# EAGLE design OpIoT_v_1_2 (EAGLE 9.1.0)
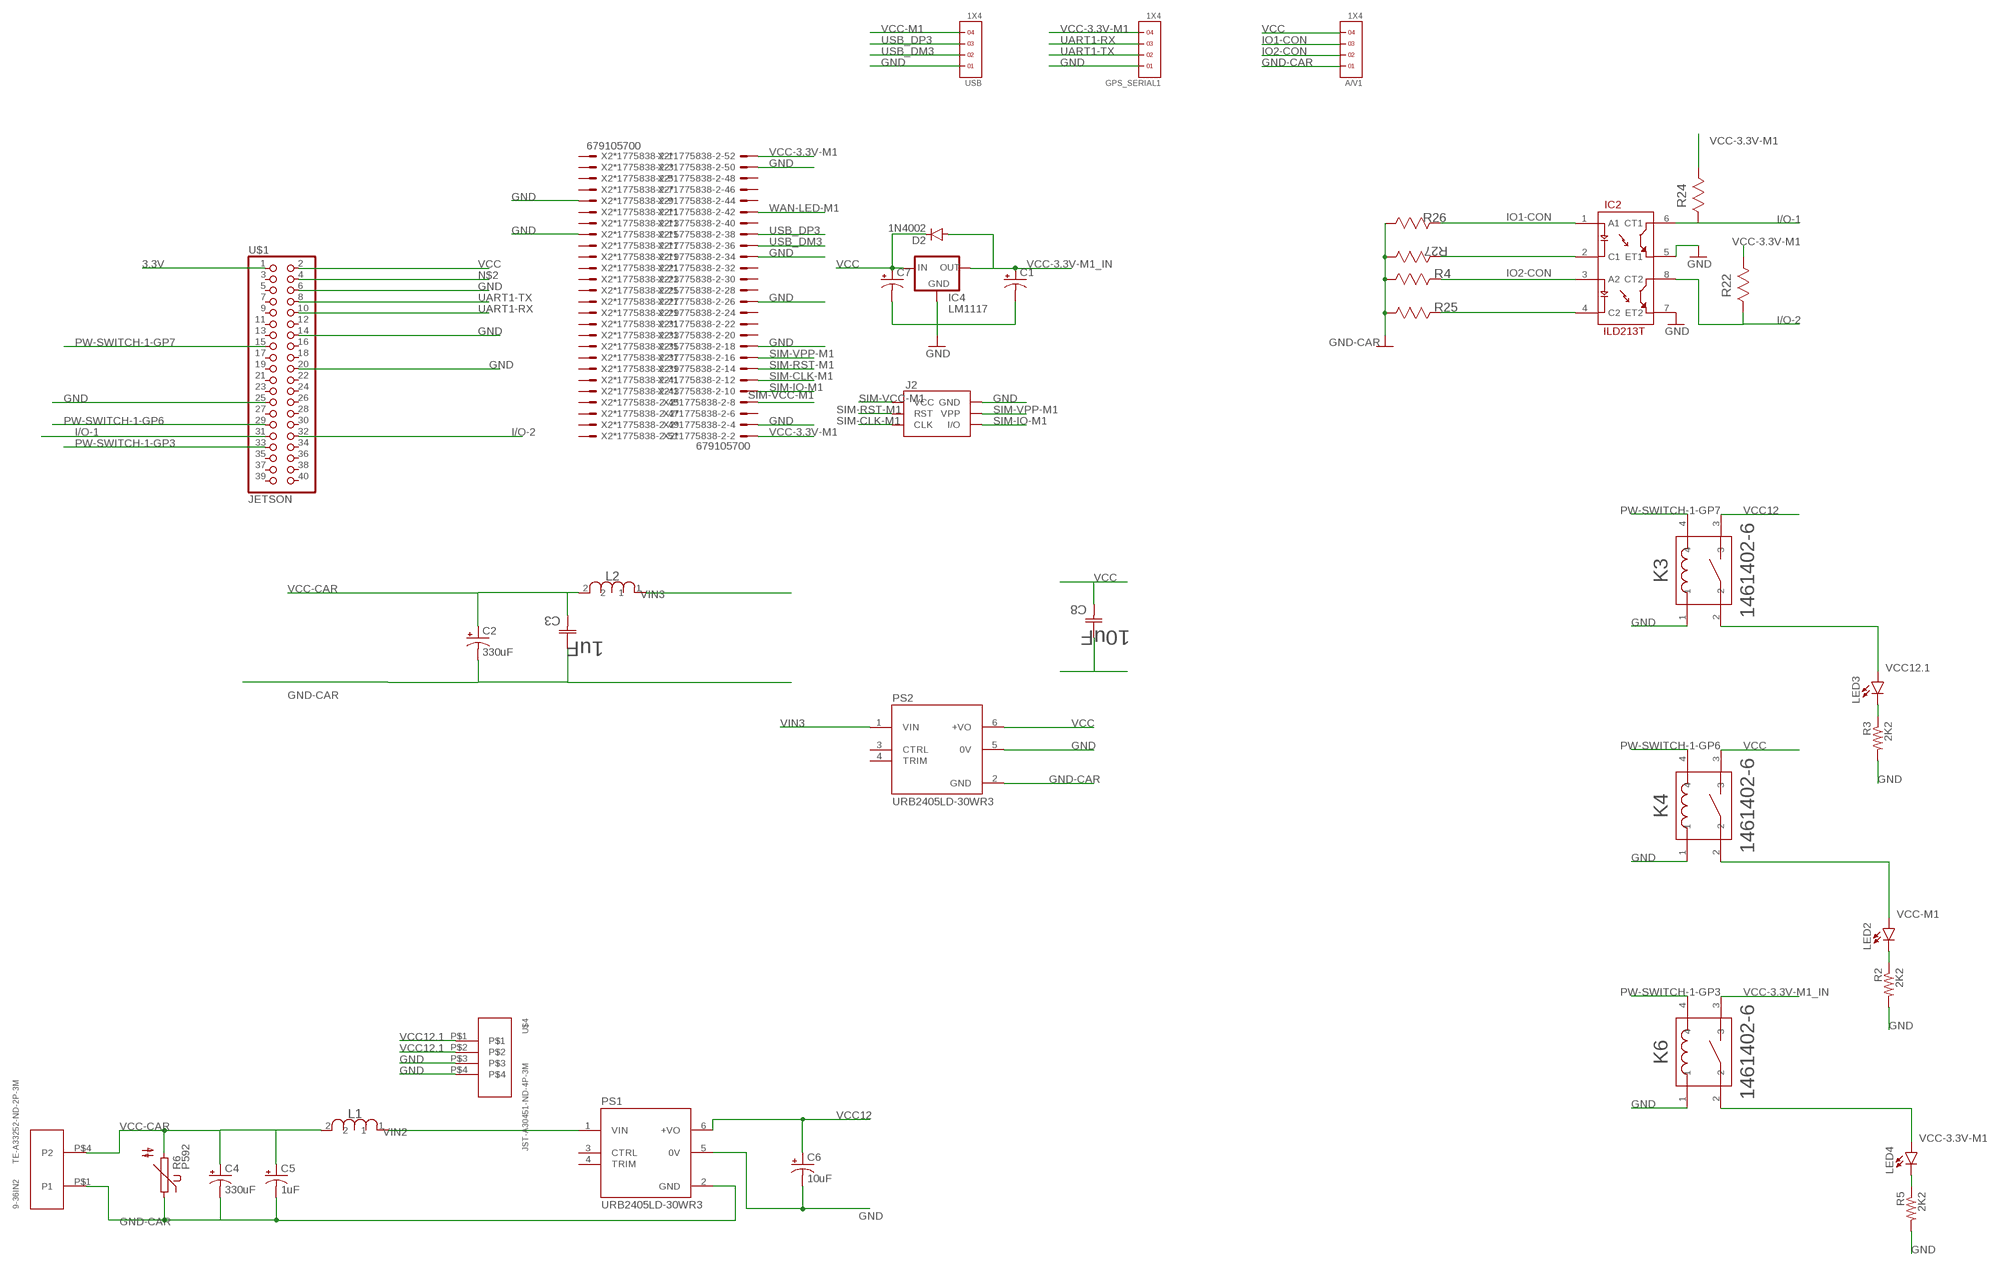
[diagram p0: schematic, sheet 1]

## Parts
9-36IN2  TE-A33252-ND-2P-3M  [TE-A33252-ND-2P-3M]
A/V1  1X4  [1X4]
C1  CAP_POL1206-KIT  [EIA3216-KIT]
C2  330uF  CPOL-USUD-10X10  [UD-10X10_NICHICON]
C3  1uF  C1206C105K5RACTU  [CAPC3216X110N]
C4  330uF  CPOL-USUD-10X10  [UD-10X10_NICHICON]
C5  1uF  CAP_POL1206-KIT  [EIA3216-KIT]
C6  10uF  CAP_POL1206-KIT  [EIA3216-KIT]
C7  CAP_POL1206-KIT  [EIA3216-KIT]
C8  10uF  C1206C105K5RACTU  [CAPC3216X110N]
D2  1N4002  DIODESMA-KIT  [SMA-DIODE-KIT]
GPS_SERIAL1  1X4  [1X4]
IC2  ILD213T  [SO08]
IC4  LM1117  [SOT223]
J2  SIMHOLDERSIM  [SIMHOLDER]
K3  1461402-6  [RELAY_1461402-6]
K4  1461402-6  [RELAY_1461402-6]
K6  1461402-6  [RELAY_1461402-6]
L1  4.7uH  PM1210-1R0J-RC  [INDC3225X22N]
L2  4.7uH  PM1210-1R0J-RC  [INDC3225X22N]
LED2  LEDCHIPLED_1206  [CHIPLED_1206]
LED3  LEDCHIPLED_1206  [CHIPLED_1206]
LED4  LEDCHIPLED_1206  [CHIPLED_1206]
PS1  URB2405LD-30WR3  [CONV_URB2405LD-30WR3]
PS2  URB2405LD-30WR3  [CONV_URB2405LD-30WR3]
R2  2K2  R-US_M1206  [M1206]
R3  2K2  R-US_M1206  [M1206]
R4  4K7  ERJ-8ENF1501V  [RESC3216X71N]
R5  2K2  R-US_M1206  [M1206]
R6  P592  [P592]
R22  300K  ERJ-8ENF1501V  [RESC3216X71N]
R24  300K  ERJ-8ENF1501V  [RESC3216X71N]
R25  2.2K  ERJ-8ENF1501V  [RESC3216X71N]
R26  4K7  ERJ-8ENF1501V  [RESC3216X71N]
R27  2.2K  ERJ-8ENF1501V  [RESC3216X71N]
U$1  JETSON  [2X20]
U$4  JST-A30451-ND-4P-3M  [TE-A30451-4P-TH-3M]
USB  1X4  [1X4]
X2*1775838-2  679105700  [679105700]

## Nets
3.3V: U$1.1
GND: C1.C(-) C6.C(-) C7.C(-) C8.1(C1) GPS_SERIAL1.1 IC2.5(ET1) IC2.7(ET2) IC4.1(GND) J2.C5(GND) K3.1 K4.1 K6.1 PS1.5(0V) PS2.5(0V) R2.2 R3.2 R5.2 U$1.6 U$1.14 U$1.20 U$1.25 U$4.P$3 U$4.P$4 USB.1 X2*1775838-2.4 X2*1775838-2.9 X2*1775838-2.15 X2*1775838-2.18 X2*1775838-2.26 X2*1775838-2.34 X2*1775838-2.50
GND-CAR: 9-36IN2.P$1(P1) A/V1.1 C2.- C3.1(C1) C4.- C5.C(-) PS1.2(GND) PS2.2(GND) R4.2(R2) R6.1 R25.1(R1) R26.2(R2) R27.1(R1)
I/O-1: IC2.6(CT1) R24.2(R2) U$1.31
I/O-2: IC2.8(CT2) R22.2(R2) U$1.32
IO1-CON: A/V1.3 IC2.1(A1) R26.1(R1)
IO2-CON: A/V1.2 IC2.3(A2) R4.1(R1)
N$2: U$1.4
N$3: LED2.C R2.1
N$4: LED3.C R3.1
N$5: LED4.C R5.1
N$7: IC2.2(C1) R27.2(R2)
N$9: IC2.4(C2) R25.2(R2)
PW-SWITCH-1-GP3: K6.4 U$1.33
PW-SWITCH-1-GP6: K4.4 U$1.29
PW-SWITCH-1-GP7: K3.4 U$1.15
SIM-CLK-M1: J2.C3(CLK) X2*1775838-2.12
SIM-IO-M1: J2.C7(I/O) X2*1775838-2.10
SIM-RST-M1: J2.C2(RST) X2*1775838-2.14
SIM-VCC-M1: J2.C1(VCC) X2*1775838-2.8
SIM-VPP-M1: J2.C6(VPP) X2*1775838-2.16
UART1-RX: GPS_SERIAL1.3 U$1.10
UART1-TX: GPS_SERIAL1.2 U$1.8
USB_DM3: USB.2 X2*1775838-2.36
USB_DP3: USB.3 X2*1775838-2.38
VCC: A/V1.4 C7.A(+) C8.2(C2) D2.C IC4.3(IN) K4.3 PS2.6(+VO) U$1.2
VCC12: C6.A(+) K3.3 PS1.6(+VO)
VCC12.1: K3.2 LED3.A U$4.P$1 U$4.P$2
VCC-3.3V-M1: GPS_SERIAL1.4 K6.2 LED4.A R22.1(R1) R24.1(R1) X2*1775838-2.2 X2*1775838-2.52
VCC-3.3V-M1_IN: C1.A(+) D2.A IC4.2(OUT) K6.3
VCC-CAR: 9-36IN2.P$4(P2) C2.+ C3.2(C2) C4.+ C5.A(+) L1.2 L2.2 R6.2
VCC-M1: K4.2 LED2.A USB.4
VIN2: L1.1 PS1.1(VIN)
VIN3: L2.1 PS2.1(VIN)
WAN-LED-M1: X2*1775838-2.42
Unconnected: PS1.3(CTRL) PS1.4(TRIM) PS2.3(CTRL) PS2.4(TRIM) U$1.3 U$1.5 U$1.7 U$1.9 U$1.11 U$1.12 U$1.13 U$1.16 U$1.17 U$1.18 U$1.19 U$1.21 U$1.22 U$1.23 U$1.24 U$1.26 U$1.27 U$1.28 U$1.30 U$1.34 U$1.35 U$1.36 U$1.37 U$1.38 U$1.39 U$1.40 X2*1775838-2.1 X2*1775838-2.3 X2*1775838-2.5 X2*1775838-2.6 X2*1775838-2.7 X2*1775838-2.11 X2*1775838-2.13 X2*1775838-2.17 X2*1775838-2.19 X2*1775838-2.20 X2*1775838-2.21 X2*1775838-2.22 X2*1775838-2.23 X2*1775838-2.24 X2*1775838-2.25 X2*1775838-2.27 X2*1775838-2.28 X2*1775838-2.29 X2*1775838-2.30 X2*1775838-2.31 X2*1775838-2.32 X2*1775838-2.33 X2*1775838-2.35 X2*1775838-2.37 X2*1775838-2.39 X2*1775838-2.40 X2*1775838-2.41 X2*1775838-2.43 X2*1775838-2.44 X2*1775838-2.45 X2*1775838-2.46 X2*1775838-2.47 X2*1775838-2.48 X2*1775838-2.49 X2*1775838-2.51

## Library data of the parts
9-36IN2 = MonkeyTech:TE-A33252-ND-2P-3M
A/V1 GPS_SERIAL1 USB = headers(2mm):1X4
C1 C5-C7 = SparkFun-Passives:CAP_POL: Capacitor Polarized These are standard SMD and PTH capacitors. Normally 10uF, 47uF, and 100uF in electrolytic and tantalum varieties. Always verify the external diameter of the through hole cap, it varies with capacity, voltage, and manufacturer. The EIA devices should be standard.
C2 C4 = rcl:CPOL-US: POLARIZED CAPACITOR, American symbol; SPICEPREFIX: C
C3 = Kemet_By_element14_Batch_1:C1206C105K5RACTU: CAPACITOR, 1206; MPN: C1206C105K5RACTU; OC_FARNELL: 1288207; OC_NEWARK: 93K6006; SUPPLIER: Kemet; TOLERANCE: ±10%; VOLTAGERATING: 50V
C8 = Kemet_By_element14_Batch_1:C1206C105K5RACTU: CAPACITOR, 1206; MPN: C1206C105K5RACTU; OC_FARNELL: 1288207; OC_NEWARK: 93K6006; SUPPLIER: Kemet; TOLERANCE: ±10%; VALUE: 1uF; VOLTAGERATING: 50V
D2 = SparkFun-DiscreteSemi:DIODE: Diode These are standard reverse protection diodes and small signal diodes. SMA package can handle up to about 1A. SOD-323 can handle about 200mA. What the SOD-323 package when ordering, there are some mfgs out there that are 5-pin packages.
IC2 = SparkFun-DiscreteSemi:ILD213T: Dual optoisolator.
IC4 = LM1117:LM1117; AVAILABILITY: Good; DESCRIPTION: Voltage stabiliser; LDO, fixed; 3.3V; 0.8A; SOT223; SMD; MF: Texas Instruments; MP: LM1117MP-3.3/NOPB; PACKAGE: SOT-223 Texas Instruments; PRICE: 0.61 USD
J2 = SparkFun-Connectors:SIMHOLDER: SIM Socket Socket for SIM cellular cards. Schematic element and footprint production proven. Spark Fun Electronics SKU : PRT-00548; PROD_ID: CONN-08536
K3 K4 K6 = 1461402-6:1461402-6: Electromechanical Relay 12VDC 320Ohm 10A SPST-NO (( 18.2mm 10.2mm 14.7mm)) THT Industrial Relay Check prices <https://pricing.snapeda.com/search/part/OJE-SH-112HM%2C000/?ref=eda>; AVAILABILITY: Warning; COMMENT: 1461402-6; DESCRIPTION: Electromechanical Relay 12VDC 320Ohm 10A SPST-NO (( 18.2mm 10.2mm 14.7mm)) THT Industrial Relay; MF: TE Connectivity; MP: OJE-SH-112HM,000; PACKAGE: None; PRICE: None; PURCHASE-URL: https://pricing.snapeda.com/search/part/OJE-SH-112HM,000/?ref=eda
L1 L2 = Bourns_By_element14_Batch_1:PM1210-1R0J-RC: CHIP INDUCTOR, 1UH, 400MA 5% 120MHZ; MPN: PM1210-1R0J-RC; OC_FARNELL: 1180462; OC_NEWARK: 63K3090; SUPPLIER: BOURNS; TOLERANCE: ±5 %; VALUE: 1.0 uH
LED2-LED4 = led:LED: LED OSRAM: - CHIPLED LG R971, LG N971, LY N971, LG Q971, LY Q971, LO R971, LY R971 LH N974, LH R974 LS Q976, LO Q976, LY Q976 LO Q996 - Hyper CHIPLED LW Q18S LB Q993, LB Q99A, LB R99A - SideLED LS A670, LO A670, LY A670, LG A670, LP A670 LB A673, LV A673, LT A673, LW A673 LH A674 LY A675 LS A676, LA A676, LO A676, LY A676, LW A676 LS A679, LY A679, LG A679 - Hyper Micro SIDELED® LS Y876, LA Y876, LO Y876, LY Y876 LT Y87S - SmartLED LW L88C, LW L88S LB L89C, LB L89S, LG L890 LS L89K, LO L89K, LY L89K LS L896, LA L896, LO L896, LY L896 - TOPLED LS T670, LO T670, LY T670, LG T670, LP T670 LSG T670, LSP T670, LSY T670, LOP T670, LYG T670 LG T671, LOG T671, LSG T671 LB T673, LV T673, LT T673, LW T673 LH T674 LS T676, LA T676, LO T676, LY T676, LB T676, LH T676, LSB T676, LW T676 LB T67C, LV T67C, LT T67C, LS T67K, LO T67K, LY T67K, LW E67C LS E67B, LA E67B, LO E67B, LY E67B, LB E67C, LV E67C, LT E67C LW T67C LS T679, LY T679, LG T679 LS T770, LO T770, LY T770, LG T770, LP T770 LB T773, LV T773, LT T773, LW T773 LH T774 LS E675, LA E675, LY E675, LS T675 LS T776, LA T776, LO T776, LY T776, LB T776 LHGB T686 LT T68C, LB T68C - Hyper Mini TOPLED® LB M676 - Mini TOPLED Santana® LG M470 LS M47K, LO M47K, LY M47K Source: http://www.osram.convergy.de LUXEON: - LUMILED® LXK2-PW12-R00, LXK2-PW12-S00, LXK2-PW14-U00, LXK2-PW14-V00 LXK2-PM12-R00, LXK2-PM12-S00, LXK2-PM14-U00 LXK2-PE12-Q00, LXK2-PE12-R00, LXK2-PE12-S00, LXK2-PE14-T00, LXK2-PE14-U00 LXK2-PB12-K00, LXK2-PB12-L00, LXK2-PB12-M00, LXK2-PB14-N00, LXK2-PB14-P00, LXK2-PB14-Q00 LXK2-PR12-L00, LXK2-PR12-M00, LXK2-PR14-Q00, LXK2-PR14-R00 LXK2-PD12-Q00, LXK2-PD12-R00, LXK2-PD12-S00 LXK2-PH12-R00, LXK2-PH12-S00 LXK2-PL12-P00, LXK2-PL12-Q00, LXK2-PL12-R00 Source: www.luxeon.com KINGBRIGHT: KA-3528ASYC Source: www.kingbright.com
PS1 PS2 = URB2405LD-30WR3:URB2405LD-30WR3: URB_LD-30WR3 series are isolated 30W DC-DC products with 4:1 input voltage; AVAILABILITY: Unavailable; DESCRIPTION: URB_LD-30WR3 series are isolated 30W DC-DC products with 4:1 input voltage; MF: MORNSUN; MP: URB2405LD-30WR3; PACKAGE: Package; PRICE: None
R2 R3 R5 = rcl:R-US_: RESISTOR, American symbol; SPICEPREFIX: R
R4 R22 R24-R27 = Panasonic_By_element14_Batch_1:ERJ-8ENF1501V: RESISTOR, 1206; MPN: ERJ-8ENF1501V; OC_FARNELL: 1748434; OC_NEWARK: 64R5441; SUPPLIER: Panasonic; TOLERANCE: ±1 %; VALUE: 1.5 KOhm; WATTAGE: 0.25 W
R6 = varistor:P592: VARISTOR
U$1 = Jetson:JETSON
U$4 = MonkeyTech:JST-A30451-ND-4P-3M
X2*1775838-2 = con-molex:679105700: MINI PCI EXPRESS CONNECTOR 0.8MM PITCH, 52 CIRCUIT Source: http://www.molex.com/pdm_docs/sd/679105700_sd.pdf; MF: MOLEX; MPN: 67910-5700; OC_FARNELL: unknown; OC_NEWARK: 93M2128

## Net classes
1 power: width 0.305 mm

## Board
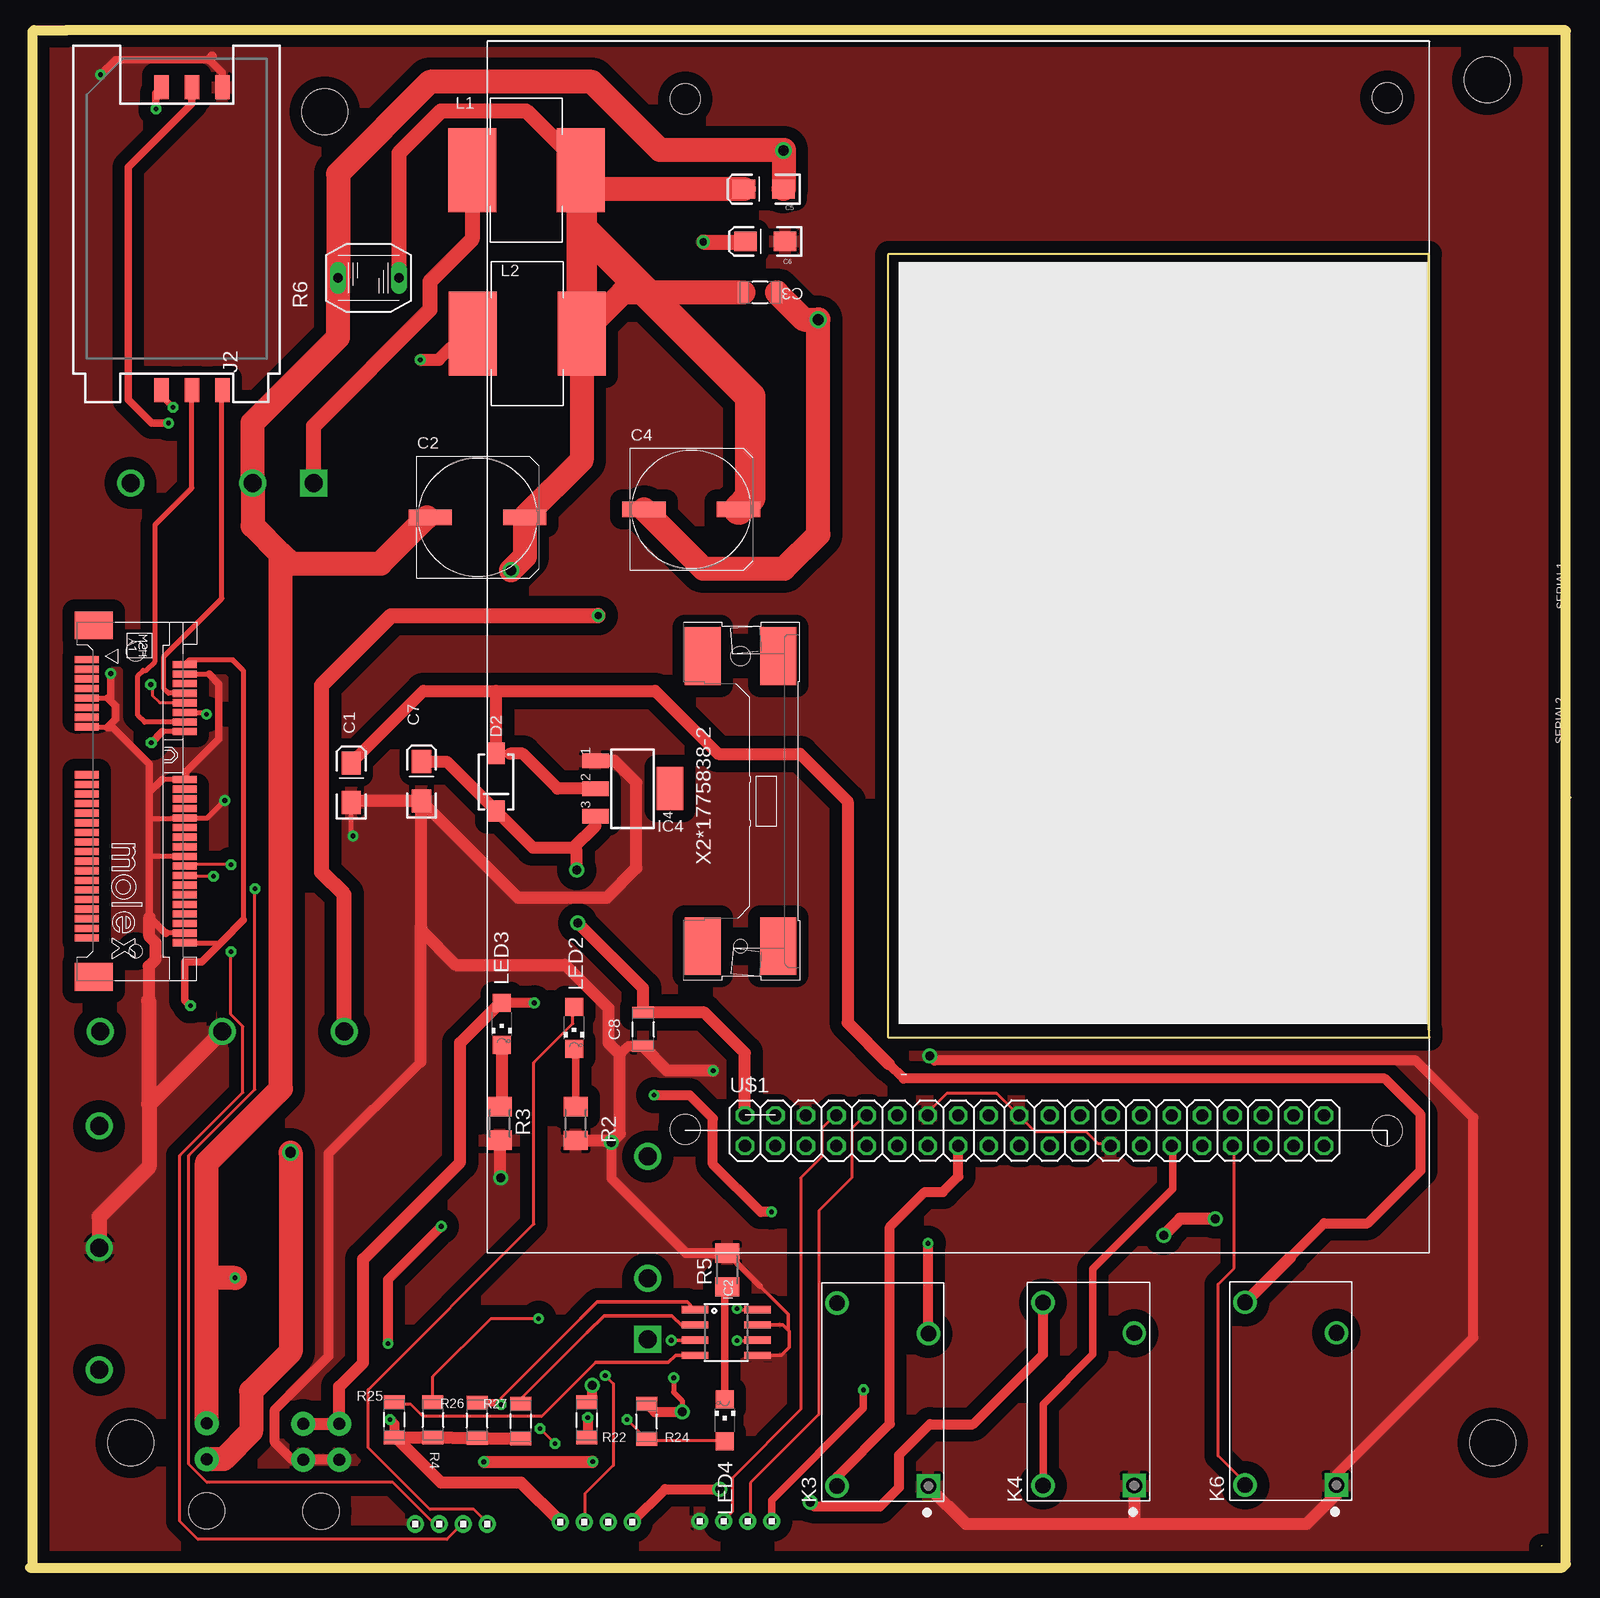
[diagram p1: board, top side]
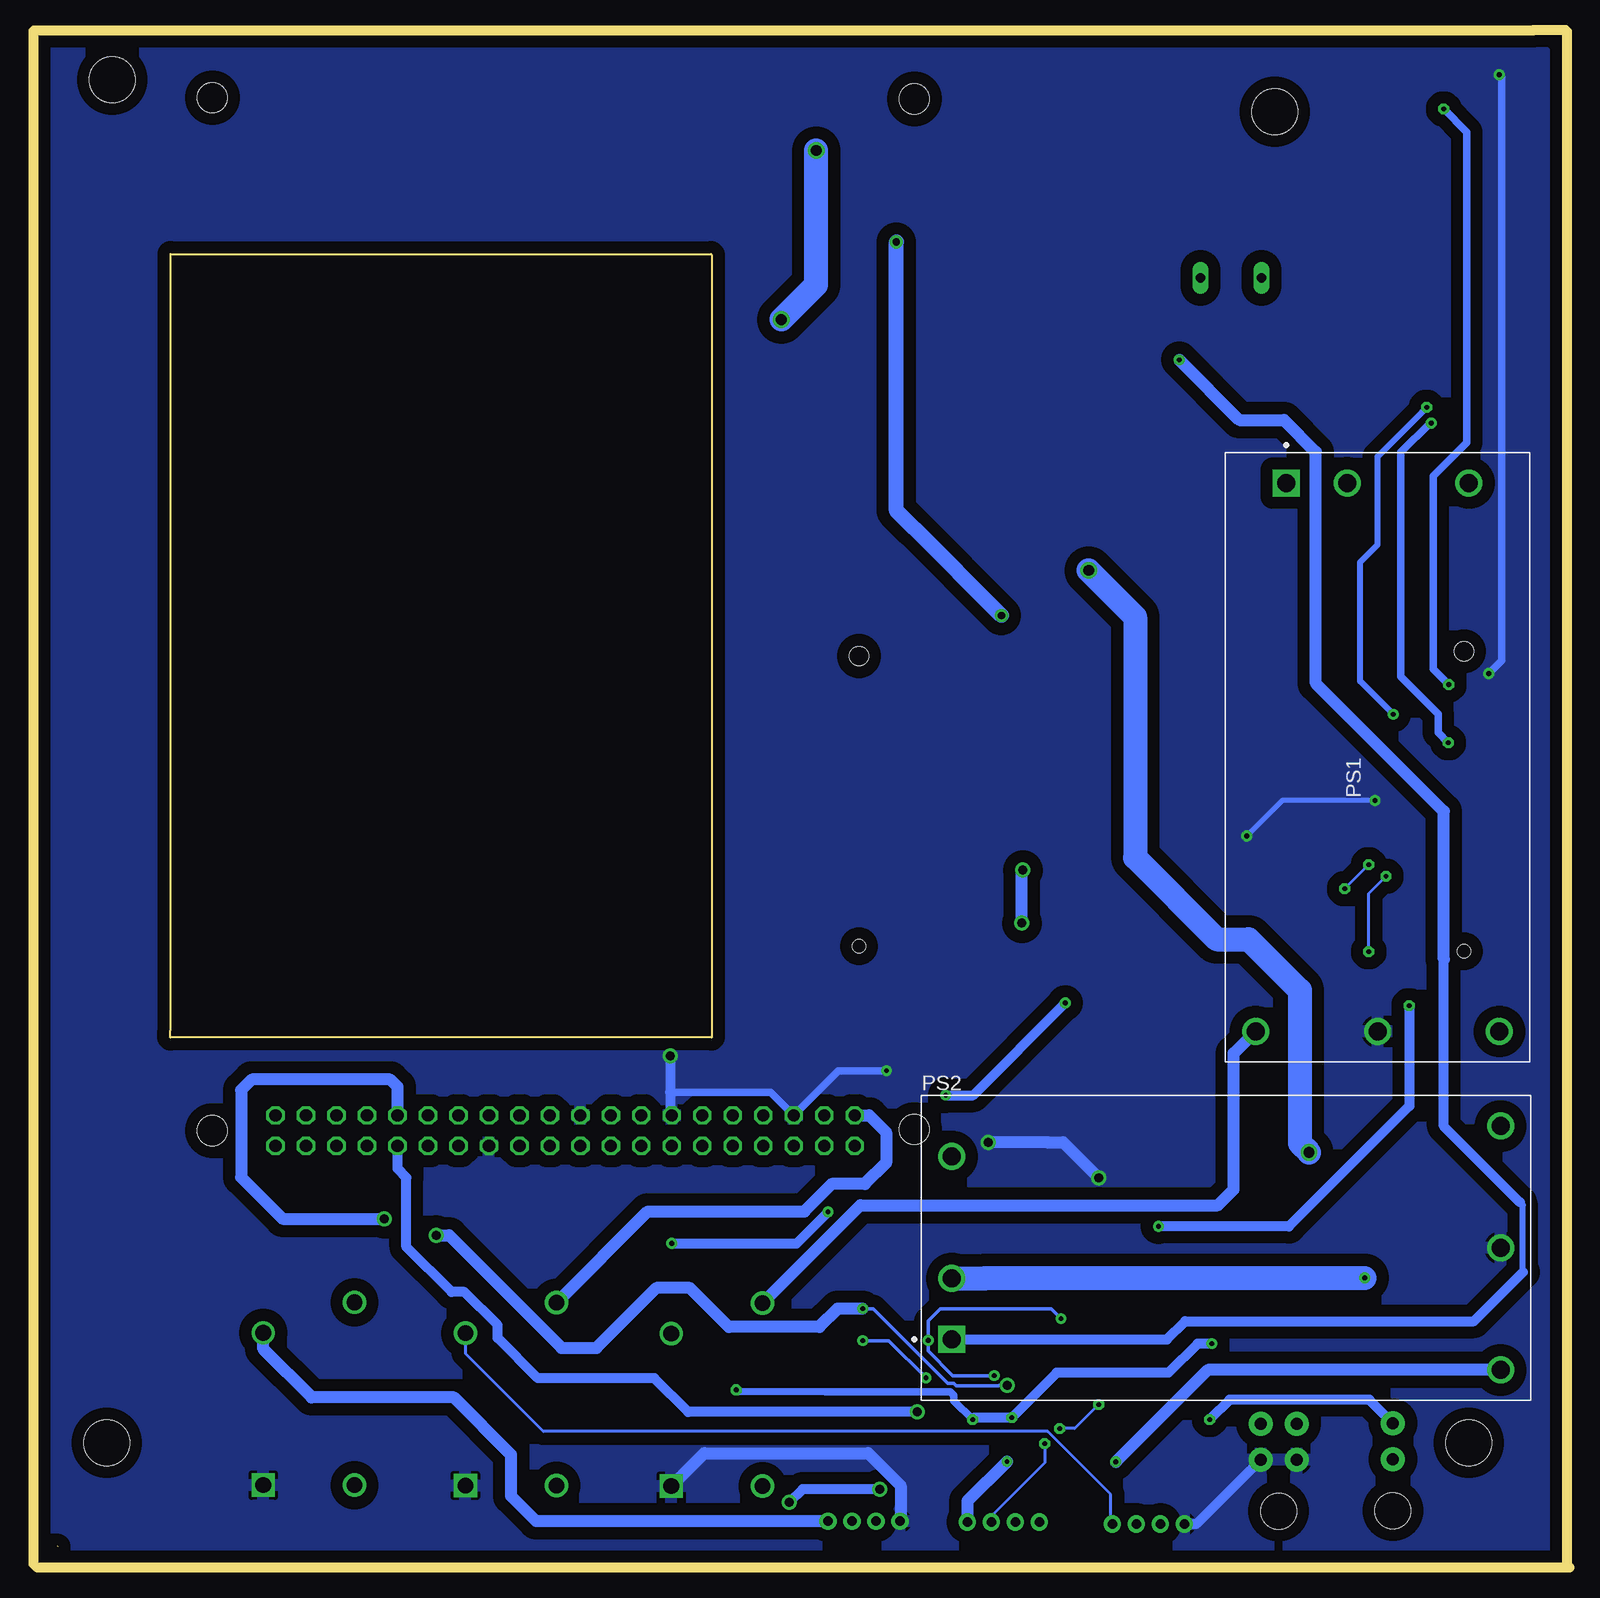
[diagram p2: board, bottom side, seen from below]

Size 128.3 x 128.18 mm. Coordinates in mm from the lower left corner, seen from the top.
Outline: 128.3,64.19 128.12,64.37
Outline: 116.58,44.81 116.58,109.48 116.6,109.5 71.56,109.5 71.49,109.42 71.49,44.23 71.52,44.2 116.61,44.2 116.64,44.23 116.6,44.27 116.6,44.8
Outline: 126.01,1.84 125.94,1.77
Outline: 0,0 127.69,0 128,0.3 128,128.11 127.96,128.15 3.04,128.15 3.02,128.16
Outline: 0.21,0 0.21,128.05 0.35,128.18 3.05,128.18
Copper layers (1*16): Top 0.035mm / dielectric 1.6mm / Bottom 0.035mm
Design rules "Check_Rule_Microcircuitos": minimum track width 0.25mm, minimum drill 0.4mm, track to track 0.25mm, track to pad 0.25mm, pad to pad 0.25mm, via to via 0.25mm, smd to smd 0mil, copper to edge 0.6mm, drill to drill 0.4mm, minimum pad ring 0.25mm, minimum via ring 0.25mm, stop-mask expansion 0mil, vias tented up to drill 0.4mm, thermal gap 0.25mm
Holes 3.81 mm at 121.9,10.41 8.39,10.41 24.57,121.38 121.45,124.05

### Footprints (pad centres in the part's own frame; a part is rotated, then mirrored left to right if it is on the bottom)
TE-A33252-ND-2P-3M = drill 1 pad 2: P$1 -0.23,-1.14; P$4 -0.23,-4.14 | hole 3: -0.23,-8.44
1X4 = drill 0.8 pad 1.422: 1 -3,0; 2 -1,0; 3 1,0; 4 3,0
EIA3216-KIT = smd 1.9 x 1.6: A 1.65,0; C -1.65,0
UD-10X10_NICHICON = smd 3.6 x 1.3: + 3.925,0; - -3.95,0
CAPC3216X110N = smd 0.914 x 1.803: 1 -1.397,0; 2 1.397,0
SMA-DIODE-KIT = smd 1.77 x 1.47: A -2.4,0; C 2.4,0
SO08 = smd 0.61 x 2.21: 1 -1.905,-2.616; 2 -0.635,-2.616; 3 0.635,-2.616; 4 1.905,-2.616; 5 1.905,2.616; 6 0.635,2.616; 7 -0.635,2.616; 8 -1.905,2.616
SOT223 = smd 1.219 x 2.235: 1 -2.311,-3.099; 2 0,-3.099; 3 2.311,-3.099 | smd 3.6 x 2.2: 4 0,3.099
SIMHOLDER = smd 2 x 1.2: C1 -12.61,-3.81; C2 -12.61,-1.27; C3 -12.61,1.27; C5 12.61,-3.81; C6 12.61,-1.27; C7 12.61,1.27
RELAY_1461402-6 = drill 1.3 square: 1 -7.62,-3.8 | drill 1.3: 2 5.08,-3.8; 3 7.62,3.8; 4 -7.62,3.8
INDC3225X22N = smd 4 x 7: 1 -0.524,0; 2 8.524,0
CHIPLED_1206 = smd 1.5 x 1.5: A 0,-1.75; C 0,1.75
CONV_URB2405LD-30WR3 = drill 1.5 square: 1 -22.86,-7.62 | drill 1.5: 2 -22.86,-2.54; 3 -22.86,7.62; 4 22.86,10.16; 5 22.86,0; 6 22.86,-10.16
M1206 = smd 1.6 x 2: 1 -1.4,0; 2 1.4,0
RESC3216X71N = smd 1.118 x 1.753: 1 -1.473,0; 2 1.473,0
P592 = drill 0.813 long: 1 0,2.54; 2 0,-2.54
2X20 = drill 1.016 octagon: 1 -28.53,0.93; 2 -28.53,3.47; 3 -25.99,0.93; 4 -25.99,3.47; 5 -23.45,0.93; 6 -23.45,3.47; 7 -20.91,0.93; 8 -20.91,3.47; 9 -18.37,0.93; 10 -18.37,3.47; 11 -15.83,0.93; 12 -15.83,3.47; 13 -13.29,0.93; 14 -13.29,3.47; 15 -10.75,0.93; 16 -10.75,3.47; 17 -8.21,0.93; 18 -8.21,3.47; 19 -5.67,0.93; 20 -5.67,3.47; 21 -3.13,0.93; 22 -3.13,3.47; 23 -0.59,0.93; 24 -0.59,3.47; 25 1.95,0.93; 26 1.95,3.47; 27 4.49,0.93; 28 4.49,3.47; 29 7.03,0.93; 30 7.03,3.47; 31 9.57,0.93; 32 9.57,3.47; 33 12.11,0.93; 34 12.11,3.47; 35 14.65,0.93; 36 14.65,3.47; 37 17.19,0.93; 38 17.19,3.47; 39 19.73,0.93; 40 19.73,3.47 | hole 2.5: 25,2.2; -33.5,2.3; -33.5,2.3; 25,88.3; -33.5,88.2
TE-A30451-4P-TH-3M = drill 1 pad 2: P$1 -1.5,-1.3; P$2 1.5,-1.3; P$3 1.5,-4.3; P$4 -1.5,-4.3 | hole 3: 0,-8.6
679105700 = smd 0.6 x 2: 1 0.7,-4.1; 2 1.1,4.1; 3 1.5,-4.1; 4 1.9,4.1; 5 2.3,-4.1; 6 2.7,4.1; 7 3.1,-4.1; 8 3.5,4.1; 9 3.9,-4.1; 10 4.3,4.1; 11 4.7,-4.1; 12 5.1,4.1; 13 5.5,-4.1; 14 5.9,4.1; 15 6.3,-4.1; 16 6.7,4.1; 17 10.3,-4.1; 18 10.7,4.1; 19 11.1,-4.1; 20 11.5,4.1; 21 11.9,-4.1; 22 12.3,4.1; 23 12.7,-4.1; 24 13.1,4.1; 25 13.5,-4.1; 26 13.9,4.1; 27 14.3,-4.1; 28 14.7,4.1; 29 15.1,-4.1; 30 15.5,4.1; 31 15.9,-4.1; 32 16.3,4.1; 33 16.7,-4.1; 34 17.1,4.1; 35 17.5,-4.1; 36 17.9,4.1; 37 18.3,-4.1; 38 18.7,4.1; 39 19.1,-4.1; 40 19.5,4.1; 41 19.9,-4.1; 42 20.3,4.1; 43 20.7,-4.1; 44 21.1,4.1; 45 21.5,-4.1; 46 21.9,4.1; 47 22.3,-4.1; 48 22.7,4.1; 49 23.1,-4.1; 50 23.5,4.1; 51 23.9,-4.1; 52 24.3,4.1 | smd 2.3 x 3.2: M1 27.15,-3.5; M2 -2.15,-3.5 | smd 4.8 x 3: M3 0.4,47.25; M4 0.4,53.55; M5 24.6,47.25; M6 24.6,53.55 | hole 1.6: 0,0; 0.4,50.4 | hole 1.1: 25,0; 24.6,50.4

### Placement (x,y rotation side)
9-36IN2  14.96,13.2 0 top
A/V1  47.18,3.81 0 top
C1  26.78,65.43 90 top
C2  37.31,87.56 0 top
C3  60.84,106.3 180 top
C4  55.12,88.22 0 top
C5  61.14,114.92 180 top
C6  61.27,110.56 180 top
C7  32.62,65.55 90 top
C8  51.09,44.88 90 top
D2  38.84,65.49 270 top
GPS_SERIAL1  58.8,3.89 0 top
IC2  58.03,19.6 270 top
IC4  50.22,64.95 270 top
J2  12.22,110.78 90 top
K3  71.06,14.42 90 top
K4  88.22,14.47 90 top
K6  105.06,14.5 90 top
L1  37.37,116.49 0 top
L2  37.44,102.89 0 top
LED2  45.34,45 180 top
LED3  39.32,45.33 180 top
LED4  57.9,12.3 0 top
PS1  16.01,67.56 270 bottom
PS2  28.62,26.65 0 bottom
R2  45.48,37.03 270 top
R3  39.16,37.04 270 top
R4  33.58,12.32 270 top
R5  58.08,24.82 90 top
R6  28.21,107.51 90 top
R22  46.39,12.32 90 top
R24  51.38,12.19 90 top
R25  30.36,12.33 90 top
R26  37.25,12.28 270 top
R27  40.89,12.22 90 top
U$1  88.11,34.23 0 top
U$4  24.25,13.31 0 top
USB  35.1,3.64 0 top
X2*1775838-2  8.81,76.39 270 top

### Tracks (layer width: path | path; a pad name or v marks a point on that pad's centre or on a via)
GND  (via drill 0.4, 0.75)
  Top 0.25: 74.82,37.97 76.38,39.53 80.56,39.53 82.24,37.85 U$1.20 82.49,37.6 83.74,36.35 87.99,36.35 88.99,35.35 89.99,35.35 U$1.25 | 12.99,65.85 X2*1775838-2.18
  Top 0.305: IC2.5 62.61,17.7 63.27,18.36 63.27,19.69 63.18,19.78 | IC2.7 62.72,20.24 63.18,19.78 | 60.85,23.46 63.18,21.12 63.18,19.78
  Top 0.406: v16.22,63.96 14.75,62.49 X2*1775838-2.26 12.87,62.45 11.73,62.45 11.7,62.42 9.95,62.42 | v26.91,60.99 26.78,61.12 C1.C | X2*1775838-2.50 11.34,52.89 | X2*1775838-2.18 11,65.69 | X2*1775838-2.4 14.92,74.49 | X2*1775838-2.9 6.48,72.49 | X2*1775838-2.34 10,59.29 | X2*1775838-2.15 6.85,70.09
  Top 0.508: R5.2 60.85,23.46
  Top 0.61: v5.87,124.44 7.15,125.72 14.95,125.72 16.03,124.64 J2.C5 | 12.99,65.85 12.99,66.31 15.75,69.06 15.75,73.67 14.92,74.49 | 11,65.69 9.95,64.64 | 9.95,64.64 9.95,62.42 9.95,59.24 | 9.95,59.24 9.95,54.23 11.31,52.87 11.34,52.89 | 10,59.29 9.95,59.24 | U$1.14 74.82,37.97 | 9.95,64.64 9.95,66.99 6.91,70.04 | 6.48,72.49 6.73,72.24 | 6.91,70.04 6.43,70.04 7.14,70.75 7.14,71.83 6.73,72.24 | v6.73,74.54 6.73,72.24 | 6.85,70.09 6.91,70.04
  Top 0.813: U$4.P$3 U$4.P$4 21.84,9.01 20.41,10.44 20.41,13.18 24.87,17.64 24.87,34.5 32.55,42.18 | R5.2 54.68,26.22 48.44,32.46 v48.44,35.45 | K6.1 108.86,7.76 120.28,19.18 120.28,37.5 115.49,42.28 75.36,42.28 v74.97,42.68 | 15.18,125.96 14.95,125.72 | 49.17,42.78 49.87,43.48 C8.1
  Top 1.016: 9.95,54.23 9.95,52.6 10.47,52.08 10.47,50.71 9.89,50.12 9.89,47.25 | K3.1 78.01,3.66 91.84,3.66 | 91.84,3.66 106.38,3.66 108.86,6.14 K6.1 | K4.1 92.02,3.84 91.84,3.66 | R3.2 39.16,32.55 v39.22,32.48 | 32.55,42.18 32.55,53.38 32.62,53.31 | 32.62,53.31 32.62,53.1 35.46,50.26 44.59,50.26 48.19,46.66 48.19,43.75 49.17,42.78 49.17,36.17 v48.44,35.45 48.27,35.63 R2.2 | 32.62,53.31 C7.C | C1.C 26.89,63.9 C7.C | C7.C 40.65,55.87 48.09,55.87 50.53,58.31 50.53,65.44 48.72,67.26 IC4.1 | v56.93,41.43 53.14,41.43 C8.1
  Top 1.27: PS2.5 5.76,29.25 9.92,33.41 9.92,38.61 | PS1.5 9.92,38.61 | 9.89,47.25 9.89,38.64 9.92,38.61
  Bottom 0.406: v16.22,63.96 23.94,63.96 v26.91,60.99
  Bottom 0.61: v6.73,74.54 5.66,75.61 5.66,124.24 v5.87,124.44 | v56.93,41.43 60.93,41.43 U$1.6 66.59,39.64 74.97,39.64
  Bottom 0.813: U$4.P$3 31.12,3.64 USB.1 | v74.97,42.68 74.97,39.64 74.97,37.85 U$1.14
  Bottom 1.016: K3.1 72.11,9.56 58.46,9.56 55.74,6.83 55.74,3.95 GPS_SERIAL1.1 | v39.22,32.48 42.2,35.47 43.47,35.47 43.49,35.45 v48.44,35.45
  pour Bottom (isolate 1.016): 1.5,125.75 1.5,1.23 2.29,0.44 126.66,0.44 126.66,127.12 2.87,127.12
  pour Top (isolate 1.016): 1.39,127.01 60.11,127.01 60.23,127.13 126.71,127.13 126.71,0.32 1.39,0.32
GND-CAR  (via drill 0.4, 0.9)
  Top 0.25: 30.24,11.1 R25.1 | v62.79,118.14 62.74,118.1 62.74,118.18
  Top 0.61: R4.2 32.46,10.85 32.44,10.86
  Top 0.813: v29.99,12.35 30.36,11.98 R25.1
  Top 1.016: A/V1.1 40.9,7.09 34.25,7.09 30.24,11.1 | R25.1 32.44,10.86 33.23,10.86 33.28,10.81 35.24,10.81 35.25,10.8 R26.2 37.31,10.75 R27.1
  Top 1.27: 33.07,87.56 C2.-
  Top 2: C3.1 64.49,104.04 v65.69,104.04 65.69,86.13 62.83,83.27 56.12,83.27 C4.- | v62.79,118.14 62.79,118.12 | 20.9,84.5 18.55,86.86 PS1.2 18.55,95.44 25.67,102.56 R6.1 25.67,116.2 33.32,123.85 46.83,123.85 52.5,118.18 62.74,118.18 62.83,118.18 62.83,114.97 C5.C | 20.9,84.5 21.72,83.69 29.2,83.69 33.07,87.56 | 9-36IN2.P$1 14.73,24.3 | 14.73,24.3 14.73,33.75 20.9,39.92 20.9,84.5 | v17.08,24.15 14.88,24.15 14.73,24.3
  Bottom 0.813: 9-36IN2.P$1 16.69,14.02 28.33,14.02 v29.99,12.35
  Bottom 2: v65.69,104.04 62.79,106.95 v62.79,118.14 | PS2.2 48.77,24.11 48.73,24.15 v17.08,24.15
I/O-1  (via drill 0.4, 0.75)
  Top 0.305: v58.91,18.93 60.6,18.93 IC2.6
  Top 0.406: v53.63,15.83 53.63,14.63 54.37,13.89 v54.37,12.98
  Top 0.813: R24.2 52.06,12.98 v54.37,12.98
  Bottom 0.305: v53.63,15.83 56.73,18.93 v58.91,18.93
  Bottom 0.813: v54.37,12.98 73.46,12.98 76.27,15.79 85.99,15.79 89.34,19.15 89.34,20.22 92.1,22.98 93.17,22.98 96.93,26.74 96.93,32.53 97.68,33.27 U$1.31
I/O-2  (via drill 0.4, 0.75)
  Top 0.25: R22.2 46.47,13.83
  Top 0.305: IC2.8 58.99,21.51 v58.91,21.59
  Top 0.813: 46.47,13.83 46.86,14.22 v46.86,15.22
  Top 1.016: v98.76,29.08 95.84,29.08 v94.47,27.71
  Bottom 0.305: v46.86,15.22 47.53,15.22 47.59,15.16 51.1,15.16 51.33,15.39 51.83,15.39 58.03,21.59 59.63,21.59
  Bottom 1.016: U$1.32 97.68,40.09 98.28,40.7 109.82,40.7 110.71,39.81 110.71,32.54 107.25,29.08 v98.76,29.08 | v94.47,27.71 93.37,27.71 83.99,18.33 81.1,18.33 76.11,23.32 73.32,23.32 70.06,20.06 62.52,20.06 60.99,21.59 59.63,21.59 v58.91,21.59
IO1-CON  (via drill 0.4)
  Top 0.25: 45.91,20.77 39.24,14.1 v39.24,13.6 | v42.49,11.6 v43.74,10.35
  Top 0.305: 45.91,20.77 47.29,22.15 54.77,22.15 IC2.1
  Top 0.61: v39.24,13.6 39.09,13.75 R26.1
  Bottom 0.25: v43.74,10.35 43.74,8.73 47.99,4.48 47.99,3.85 A/V1.3 | v42.49,11.6 41.24,11.6 v39.24,13.6
IO2-CON  (via drill 0.4)
  Top 0.25: R4.1 33.58,15.94 38.4,20.76 v42.38,20.76 | v47.94,16.01 48.61,15.34 48.61,8.53 46.24,6.16 46.24,3.85 A/V1.2
  Top 0.305: IC2.3 v53.46,18.97 v53.45,18.96
  Bottom 0.305: v42.38,20.76 43.19,21.58 52.43,21.58 53.45,20.56 v53.45,18.96 53.45,18.07 51.39,16.01 v47.94,16.01
N$3
  Top 0.61: LED2.C 45.48,43.11 R2.1
N$4
  Top 0.25: 39.16,38.46 R3.1
  Top 1.016: LED3.C 39.32,38.61 39.16,38.46
N$5
  Top 0.25: 57.99,23.35 R5.1
  Top 0.61: LED4.C 57.9,23.26 57.99,23.35
N$7
  Top 0.25: R27.2 40.89,14.06 46.43,19.6
  Top 0.305: 46.43,19.6 47.84,21.01 53.49,21.01 54.31,20.19 55.36,20.19 IC2.2
N$9
  Top 0.25: 47.13,17.1 42.63,12.6 32.74,12.6 31.74,13.6 30.49,13.6 R25.2
  Top 0.305: IC2.4 53.8,17.7 53.2,17.1 47.13,17.1
PW-SWITCH-1-GP3
  Top 0.25: K6.4 101.24,7.1 99.01,9.33 99.01,23.63 100.34,24.96 100.34,35.04 U$1.33
PW-SWITCH-1-GP6
  Top 0.61: K4.4 84.42,13.62 88.58,17.78 88.58,24.91 95.22,31.56 95.22,35.08 U$1.29
PW-SWITCH-1-GP7
  Top 0.813: K3.4 67.26,7.58 71.66,11.98 71.66,28.4 74.57,31.31 76.07,31.31 77.36,32.6 U$1.15
SIM-CLK-M1  (via drill 0.4)
  Top 0.406: X2*1775838-2.12 14.56,71.29
  Top 0.508: 14.56,71.29 v14.71,71.14 | J2.C3 | J2.C3 10.95,97.69 v11.92,96.72
  Bottom 0.508: v14.71,71.14 17.46,73.9 17.46,83.82 16,85.28 16,92.64 12.3,96.34 v11.92,96.72
SIM-IO-M1  (via drill 0.4)
  Top 0.25: v10.07,73.61 10.19,73.49 10.19,72.7 10.8,72.1 12.74,72.1 X2*1775838-2.10
  Top 0.61: J2.C7 10.49,122.93 v10.49,121.6
  Bottom 0.61: v10.07,73.61 11.38,74.91 11.38,90.99 8.56,93.81 8.56,119.67 v10.49,121.6
SIM-RST-M1
  Top 0.406: J2.C2 13.49,90.01 10.42,86.94 10.42,75.55 9.65,74.79 9.43,74.79 8.99,74.35 8.99,71.05 9.54,70.49 X2*1775838-2.14
SIM-VCC-M1
  Top 0.25: 15.99,98.1 J2.C1
  Top 0.406: X2*1775838-2.8 11.52,72.89 11.15,73.26 11.15,75.95 15.99,80.79 15.99,98.1
SIM-VPP-M1  (via drill 0.4)
  Top 0.25: 13.49,123.35 J2.C6
  Top 0.406: X2*1775838-2.16 11.04,69.69
  Top 0.61: 11.04,69.69 v10.11,68.76 | v11.54,95.4 10.15,95.4 8.2,97.35 8.2,116.73 13.49,122.02 13.49,123.35
  Bottom 0.61: v10.11,68.76 10.94,69.6 10.94,71.16 14.06,74.27 14.06,92.98 11.63,95.4 v11.54,95.4
UART1-RX
  Top 0.25: GPS_SERIAL1.3 59.86,3.89 60.03,4.06 60.03,7.07 65.74,12.78 65.74,29.76 68.49,32.51 68.49,36.6 69.49,37.6 U$1.10
UART1-TX
  Top 0.25: GPS_SERIAL1.2 58.5,4.68 58.5,7.47 64.23,13.19 64.23,32.48 65.99,34.25 65.99,36.6 66.99,37.6 U$1.8
USB_DM3  (via drill 0.4)
  Top 0.25: v16.74,58.6 12.99,58.6 X2*1775838-2.36 | v18.74,56.6 18.74,39.85 13.24,34.35 13.24,8.6 14.74,7.1 30.24,7.1 33.49,3.85 33.99,3.85 USB.2
  Bottom 0.25: v18.74,56.6 v16.74,58.6
USB_DP3  (via drill 0.4)
  Top 0.25: v16.74,51.35 16.74,46.1 17.74,45.1 17.74,39.6 12.49,34.35 12.49,3.85 13.99,2.35 34.74,2.35 35.99,3.6 USB.3 | X2*1775838-2.38 12.99,57.6 15.26,57.6 v15.3,57.64
  Bottom 0.25: v15.3,57.64 16.74,56.2 v16.74,51.35
VCC  (via drill 0.4, 0.75)
  Top 0.813: A/V1.4 52.93,6.56 v57.47,6.56 | v65.03,5.44 65.37,5.1 70.84,5.1 72.44,6.69 72.44,9.39 75,11.96 78.6,11.96 84.42,17.78 K4.3
  Top 1.016: 45.29,60.02 41.91,60.02 D2.C 34.72,67.2 C7.A | 45.29,60.02 47.12,61.85 IC4.3 | U$1.2 59.58,42.9 56.21,46.27 C8.2 51.09,48.29 v45.64,53.74 | v45.56,58.14 45.56,59.75 45.29,60.02 | v37.82,8.82 46.86,8.82 v46.88,8.84
  Bottom 0.813: v57.47,6.56 63.92,6.56 v65.03,5.44
  Bottom 1.016: v45.64,53.74 45.64,58.06 v45.56,58.14 | K4.3 76.82,29.69 63.78,29.69 61.49,31.98 58.73,31.98 56.96,33.74 56.96,36.29 58.37,37.7 U$1.2 | PS2.6 30.14,16.49 v37.82,8.82 | v46.88,8.84 50.18,5.55 A/V1.4
VCC12  (via drill 0.6)
  Top 1.27: PS1.6 26.17,56.1 24.3,57.97 24.3,73.57 30.09,79.37 47.35,79.37 v47.35,79.38 | v56.11,110.51 59.57,110.51 C6.A
  Bottom 1.016: K3.3 59.1,30.21 29.31,30.21 27.99,31.53 27.99,42.88 PS1.6
  Bottom 1.27: v47.35,79.38 54.57,86.6 54.6,86.6 56.11,88.11 v56.11,110.51
VCC12.1  (via drill 0.4)
  Top 0.813: K3.2 74.86,27 v74.83,27.03 | v61.8,29.66 60.9,29.66 56.92,33.64 56.92,37.45 54.98,39.39 v52,39.39 | v42.02,47.08 39.17,47.08
  Top 1.016: U$4.P$1 U$4.P$2 25.75,15.08 27.76,17.08 27.76,25.71 35.85,33.8 35.85,43.76 39.17,47.08 LED3.A
  Bottom 0.813: v74.83,27.03 64.42,27.03 v61.8,29.66 | v52,39.39 49.71,39.39 v42.02,47.08
VCC-3.3V-M1  (via drill 0.4)
  Top 0.25: LED4.A 57.74,10.6 51.49,10.6 R24.1 51.24,10.85 v49.74,12.35
  Top 0.406: 17.77,53.98 17.77,74.78 16.86,75.69 13.31,75.69 X2*1775838-2.2 | X2*1775838-2.52 15.89,52.09 16.01,52.22
  Top 0.61: v69.46,14.82 69.46,13.28 61.8,5.62 GPS_SERIAL1.4 | v13.38,46.84 12.91,47.3 12.91,50.5 14.3,50.5 16.01,52.22 17.77,53.98
  Top 0.813: v34.26,28.44 29.83,24.01 v29.83,18.68 | v46.49,12.51 46.49,10.95 R22.1
  Bottom 0.61: v69.46,14.82 69.46,14.69 62.03,14.68 51.62,14.68 51.31,14.36 51.31,13.91 v49.74,12.35
  Bottom 0.813: v13.38,46.84 13.35,46.82 13.35,38.49 23.39,28.44 v34.26,28.44 | v29.83,18.68 31.01,18.68 33.43,16.25 42.74,16.25 v46.49,12.51 49.58,12.51 v49.74,12.35
  Bottom 1.016: GPS_SERIAL1.4 86.12,3.89 88.2,5.97 88.2,9.42 92.97,14.19 104.83,14.19 108.86,18.22 K6.2
VCC-3.3V-M1_IN
  Top 0.61: 40,67.86 38.87,67.86 D2.A
  Top 0.813: 105.01,25.87 107.85,28.71 111.48,28.71 115.88,33.12 115.88,37.77 112.89,40.77 72.8,40.77 71.6,41.96
  Top 1.016: D2.A 38.84,73.09 | C1.A 32.78,73.09 38.84,73.09 | 38.84,73.09 52.1,73.09 57.35,67.84 64.18,67.84 68.13,63.89 68.13,45.44 71.6,41.96 | K6.3 105.01,25.87 | IC4.2 43.98,64.95 41.06,67.86 40,67.86
VCC-CAR  (via drill 0.9)
  Top 0.25: 45.96,116.43 L1.2 | 41.24,87.6 C2.+ | 45.99,102.86 L2.2
  Top 1.27: R6.2 30.75,117.95 34.25,121.45 41.34,121.45 45.96,116.82 45.96,116.43
  Top 2: 41.24,87.6 45.96,92.32 L2.2 49.38,106.3 C3.2 | C2.+ 41.24,84.3 v40.08,83.14 | v21.71,34.61 21.71,18.01 18.42,14.72 18.42,11.35 16.13,9.06 9-36IN2.P$4 | C5.A 47.46,114.92 L1.2
  Top 2.54: 45.99,102.86 45.99,107.35 45.99,111.65 60.03,97.61 60.03,89.21 C4.+ | 45.96,116.43 L2.2
  Bottom 2: v40.08,83.14 36.21,79.27 36.21,59.2 29.4,52.39 26.75,52.39 22.49,48.12 22.49,35.39 v21.71,34.61
VCC-M1
  Top 0.25: LED2.A 45.24,46.6 45.24,45.35 41.99,42.1 41.99,28.66 28.17,14.84 28.17,10 33.33,4.85 36.99,4.85 37.99,3.85 USB.4
  Bottom 0.25: K4.2 92.02,17.85 85.52,11.35 43.49,11.35 38.24,6.1 38.24,3.85 USB.4
VIN2
  Top 1.27: PS1.1 23.63,95.17 33.33,104.87 33.33,107.21 36.85,110.73 L1.1
VIN3  (via drill 0.4)
  Top 0.25: 36.74,102.68 L2.1
  Top 1.016: v32.53,100.68 34.08,100.68 36.08,102.68 36.74,102.68
  Bottom 0.508: 3.89,24.63 3.89,30.21 4.14,30.46
  Bottom 0.813: 3.89,24.63 7.98,20.54 32.04,20.54 33.55,19.03 PS2.1 | 10.47,50.71 10.47,36.79 4.14,30.46
  Bottom 1.016: 10.47,50.71 10.47,63.04 21.14,73.71 21.14,93.01 23.8,95.68 27.52,95.68 v32.53,100.68

### Text on the board
tPlace: SERIAL1 | SERIAL2